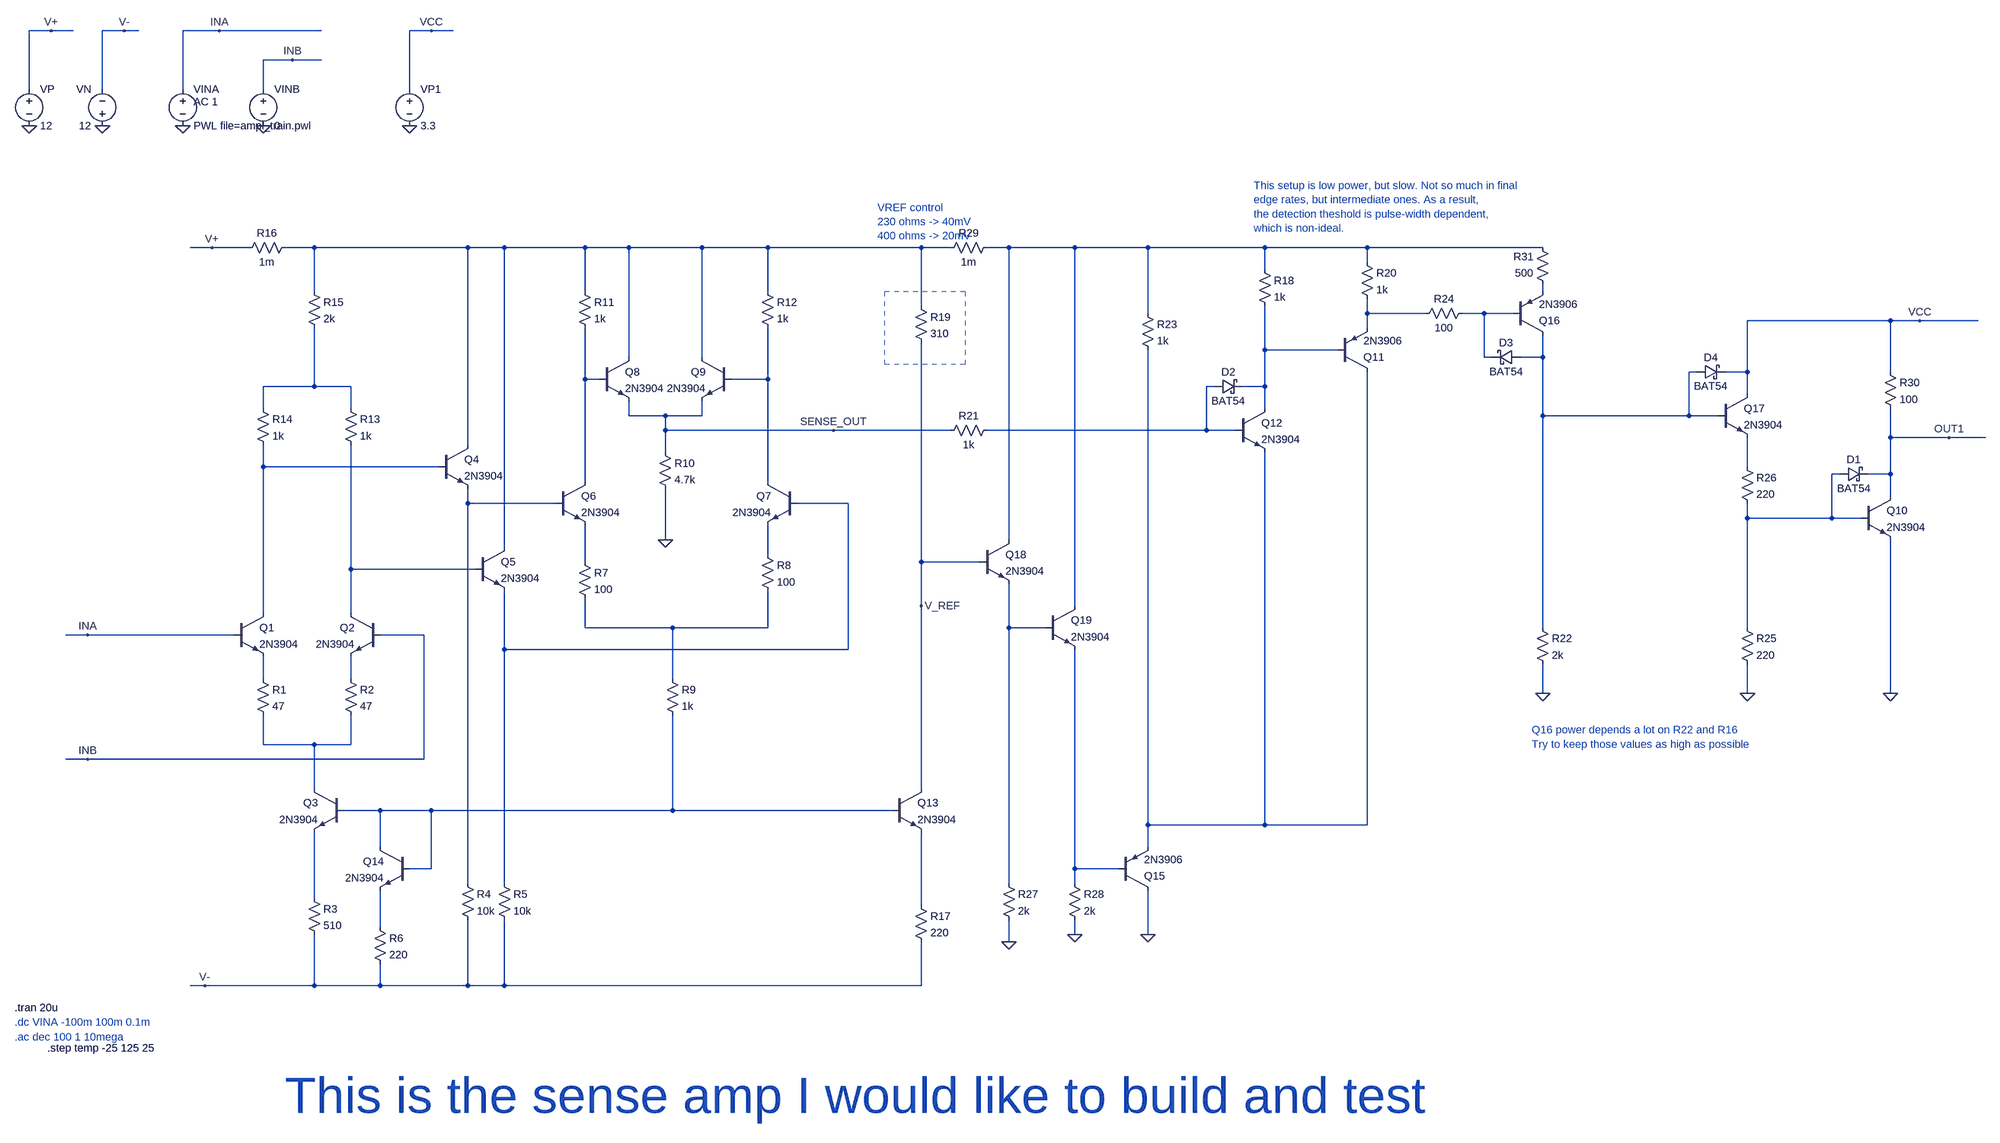
[diagram p0: schematic sense_amp2.asc]
sense_amp2.asc, the LTspice schematic file:
Version 4.1
SHEET 1 4868 1236
WIRE -224 -1328 -272 -1328
WIRE -176 -1328 -224 -1328
WIRE -64 -1328 -112 -1328
WIRE -32 -1328 -64 -1328
WIRE 144 -1328 64 -1328
WIRE 368 -1328 144 -1328
WIRE 608 -1328 560 -1328
WIRE 656 -1328 608 -1328
WIRE 304 -1264 240 -1264
WIRE 368 -1264 304 -1264
WIRE -272 -1200 -272 -1328
WIRE -112 -1200 -112 -1328
WIRE 64 -1200 64 -1328
WIRE 240 -1200 240 -1264
WIRE 560 -1200 560 -1328
WIRE 128 -688 80 -688
WIRE 208 -688 128 -688
WIRE 352 -688 288 -688
WIRE 688 -688 352 -688
WIRE 768 -688 688 -688
WIRE 944 -688 768 -688
WIRE 1040 -688 944 -688
WIRE 1200 -688 1040 -688
WIRE 1344 -688 1200 -688
WIRE 1680 -688 1344 -688
WIRE 1744 -688 1680 -688
WIRE 1872 -688 1824 -688
WIRE 2016 -688 1872 -688
WIRE 2176 -688 2016 -688
WIRE 2432 -688 2176 -688
WIRE 2656 -688 2432 -688
WIRE 3040 -688 2656 -688
WIRE 2656 -656 2656 -688
WIRE 2432 -640 2432 -688
WIRE 352 -592 352 -688
WIRE 944 -592 944 -688
WIRE 1344 -592 1344 -688
WIRE 3040 -592 3040 -608
WIRE 1680 -560 1680 -688
WIRE 2176 -544 2176 -688
WIRE 2656 -544 2656 -576
WIRE 2784 -544 2656 -544
WIRE 2912 -544 2864 -544
WIRE 2976 -544 2912 -544
WIRE 3856 -528 3488 -528
WIRE 3920 -528 3856 -528
WIRE 4048 -528 3920 -528
WIRE 2656 -512 2656 -544
WIRE 2432 -464 2432 -560
WIRE 2592 -464 2432 -464
WIRE 1040 -448 1040 -688
WIRE 1200 -448 1200 -688
WIRE 2912 -448 2912 -544
WIRE 2928 -448 2912 -448
WIRE 3040 -448 3040 -496
WIRE 3040 -448 2992 -448
WIRE 3376 -416 3360 -416
WIRE 3488 -416 3488 -528
WIRE 3488 -416 3440 -416
WIRE 3856 -416 3856 -528
WIRE 944 -400 944 -512
WIRE 976 -400 944 -400
WIRE 1344 -400 1344 -512
WIRE 1344 -400 1264 -400
WIRE 352 -384 352 -512
WIRE 352 -384 240 -384
WIRE 432 -384 352 -384
WIRE 2320 -384 2304 -384
WIRE 2432 -384 2432 -464
WIRE 2432 -384 2384 -384
WIRE 3488 -368 3488 -416
WIRE 240 -336 240 -384
WIRE 432 -336 432 -384
WIRE 2432 -336 2432 -384
WIRE 1040 -320 1040 -352
WIRE 1120 -320 1040 -320
WIRE 1200 -320 1200 -352
WIRE 1200 -320 1120 -320
WIRE 3040 -320 3040 -448
WIRE 3360 -320 3360 -416
WIRE 3360 -320 3040 -320
WIRE 3424 -320 3360 -320
WIRE 1120 -288 1120 -320
WIRE 1488 -288 1120 -288
WIRE 1744 -288 1488 -288
WIRE 2304 -288 2304 -384
WIRE 2304 -288 1824 -288
WIRE 2368 -288 2304 -288
WIRE 3856 -272 3856 -336
WIRE 3984 -272 3856 -272
WIRE 4064 -272 3984 -272
WIRE 688 -256 688 -688
WIRE 1120 -240 1120 -288
WIRE 240 -208 240 -256
WIRE 624 -208 240 -208
WIRE 3488 -208 3488 -272
WIRE 3744 -192 3728 -192
WIRE 3856 -192 3856 -272
WIRE 3856 -192 3808 -192
WIRE 944 -176 944 -400
WIRE 1344 -176 1344 -400
WIRE 3856 -144 3856 -192
WIRE 688 -128 688 -160
WIRE 880 -128 688 -128
WIRE 1520 -128 1408 -128
WIRE 3488 -96 3488 -128
WIRE 3728 -96 3728 -192
WIRE 3728 -96 3488 -96
WIRE 3792 -96 3728 -96
WIRE 1120 -48 1120 -160
WIRE 1872 -48 1872 -688
WIRE 768 -32 768 -688
WIRE 1344 -16 1344 -80
WIRE 944 0 944 -80
WIRE 1680 0 1680 -480
WIRE 1808 0 1680 0
WIRE 432 16 432 -256
WIRE 704 16 432 16
WIRE 1680 96 1680 0
WIRE 2016 96 2016 -688
WIRE 240 112 240 -208
WIRE 432 112 432 16
WIRE 944 144 944 80
WIRE 1136 144 944 144
WIRE 1344 144 1344 64
WIRE 1344 144 1136 144
WIRE 1872 144 1872 48
WIRE 1952 144 1872 144
WIRE 3040 144 3040 -320
WIRE 3488 144 3488 -96
WIRE -144 160 -192 160
WIRE 176 160 -144 160
WIRE 592 160 496 160
WIRE 768 192 768 64
WIRE 1520 192 1520 -128
WIRE 1520 192 768 192
WIRE 240 256 240 208
WIRE 432 256 432 208
WIRE 1136 256 1136 144
WIRE 3040 288 3040 224
WIRE 3488 288 3488 224
WIRE 3856 288 3856 -48
WIRE 240 400 240 336
WIRE 352 400 240 400
WIRE 432 400 432 336
WIRE 432 400 352 400
WIRE -144 432 -192 432
WIRE 592 432 592 160
WIRE 592 432 -144 432
WIRE 352 496 352 400
WIRE 1680 496 1680 96
WIRE 496 544 416 544
WIRE 608 544 496 544
WIRE 1136 544 1136 336
WIRE 1136 544 608 544
WIRE 1616 544 1136 544
WIRE 2176 576 2176 -464
WIRE 2432 576 2432 -240
WIRE 2432 576 2176 576
WIRE 2656 576 2656 -416
WIRE 2656 576 2432 576
WIRE 496 624 496 544
WIRE 2176 624 2176 576
WIRE 608 672 608 544
WIRE 608 672 560 672
WIRE 2016 672 2016 192
WIRE 2112 672 2016 672
WIRE 688 704 688 -128
WIRE 768 704 768 192
WIRE 1872 704 1872 144
WIRE 2016 704 2016 672
WIRE 352 736 352 592
WIRE 1680 752 1680 592
WIRE 496 800 496 720
WIRE 2016 816 2016 784
WIRE 2176 816 2176 720
WIRE 1872 832 1872 784
WIRE 112 928 80 928
WIRE 352 928 352 816
WIRE 352 928 112 928
WIRE 496 928 496 880
WIRE 496 928 352 928
WIRE 688 928 688 784
WIRE 688 928 496 928
WIRE 768 928 768 784
WIRE 768 928 688 928
WIRE 1680 928 1680 832
WIRE 1680 928 768 928
FLAG 1488 -288 SENSE_OUT
FLAG -144 160 INA
FLAG -144 432 INB
FLAG 128 -688 V+
FLAG 112 928 V-
FLAG -272 -1120 0
FLAG 64 -1120 0
FLAG -112 -1120 0
FLAG 240 -1120 0
FLAG -224 -1328 V+
FLAG -64 -1328 V-
FLAG 144 -1328 INA
FLAG 304 -1264 INB
FLAG 1120 -48 0
FLAG 1680 96 V_REF
FLAG 2176 816 0
FLAG 3040 288 0
FLAG 3984 -272 OUT1
FLAG 560 -1120 0
FLAG 608 -1328 VCC
FLAG 3856 288 0
FLAG 3920 -528 VCC
FLAG 3488 288 0
FLAG 1872 832 0
FLAG 2016 816 0
SYMBOL npn 176 112 R0
SYMATTR InstName Q1
SYMATTR Value 2N3904
SYMBOL res 224 240 R0
SYMATTR InstName R1
SYMATTR Value 47
SYMBOL res 416 240 R0
SYMATTR InstName R2
SYMATTR Value 47
SYMBOL npn 496 112 M0
SYMATTR InstName Q2
SYMATTR Value 2N3904
SYMBOL npn 416 496 M0
SYMATTR InstName Q3
SYMATTR Value 2N3904
SYMBOL npn 624 -256 R0
SYMATTR InstName Q4
SYMATTR Value 2N3904
SYMBOL npn 704 -32 R0
SYMATTR InstName Q5
SYMATTR Value 2N3904
SYMBOL npn 880 -176 R0
SYMATTR InstName Q6
SYMATTR Value 2N3904
SYMBOL npn 1408 -176 M0
SYMATTR InstName Q7
SYMATTR Value 2N3904
SYMBOL npn 976 -448 R0
SYMATTR InstName Q8
SYMATTR Value 2N3904
SYMBOL npn 1264 -448 M0
SYMATTR InstName Q9
SYMATTR Value 2N3904
SYMBOL res 336 720 R0
SYMATTR InstName R3
SYMATTR Value 510
SYMBOL res 672 688 R0
SYMATTR InstName R4
SYMATTR Value 10k
SYMBOL res 752 688 R0
SYMATTR InstName R5
SYMATTR Value 10k
SYMBOL res 480 784 R0
SYMATTR InstName R6
SYMATTR Value 220
SYMBOL res 928 -16 R0
SYMATTR InstName R7
SYMATTR Value 100
SYMBOL res 1328 -32 R0
SYMATTR InstName R8
SYMATTR Value 100
SYMBOL res 1120 240 R0
SYMATTR InstName R9
SYMATTR Value 1k
SYMBOL res 1104 -256 R0
SYMATTR InstName R10
SYMATTR Value 4.7k
SYMBOL res 928 -608 R0
SYMATTR InstName R11
SYMATTR Value 1k
SYMBOL res 1328 -608 R0
SYMATTR InstName R12
SYMATTR Value 1k
SYMBOL res 416 -352 R0
SYMATTR InstName R13
SYMATTR Value 1k
SYMBOL res 224 -352 R0
SYMATTR InstName R14
SYMATTR Value 1k
SYMBOL res 336 -608 R0
SYMATTR InstName R15
SYMATTR Value 2k
SYMBOL voltage -272 -1216 R0
SYMATTR InstName VP
SYMATTR Value 12
SYMBOL voltage -112 -1104 R180
WINDOW 0 24 96 Left 2
WINDOW 3 24 16 Left 2
SYMATTR InstName VN
SYMATTR Value 12
SYMBOL voltage 64 -1216 R0
WINDOW 123 24 44 Left 2
WINDOW 39 0 0 Left 0
SYMATTR Value2 AC 1
SYMATTR InstName VINA
SYMATTR Value PWL file=ampl_train.pwl
SYMBOL voltage 240 -1216 R0
WINDOW 123 0 0 Left 0
WINDOW 39 0 0 Left 0
SYMATTR InstName VINB
SYMATTR Value 0
SYMBOL npn 560 624 M0
SYMATTR InstName Q14
SYMATTR Value 2N3904
SYMBOL npn 2368 -336 R0
SYMATTR InstName Q12
SYMATTR Value 2N3904
SYMBOL npn 1616 496 R0
SYMATTR InstName Q13
SYMATTR Value 2N3904
SYMBOL res 1664 736 R0
SYMATTR InstName R17
SYMATTR Value 220
SYMBOL res 1664 -576 R0
SYMATTR InstName R19
SYMATTR Value 310
SYMBOL res 1840 -304 R90
WINDOW 0 0 56 VBottom 2
WINDOW 3 32 56 VTop 2
SYMATTR InstName R21
SYMATTR Value 1k
SYMBOL res 2160 -560 R0
SYMATTR InstName R23
SYMATTR Value 1k
SYMBOL res 3024 128 R0
SYMATTR InstName R22
SYMATTR Value 2k
SYMBOL pnp 2976 -496 M180
SYMATTR InstName Q16
SYMATTR Value 2N3906
SYMBOL voltage 560 -1216 R0
SYMATTR InstName VP1
SYMATTR Value 3.3
SYMBOL res 3840 -432 R0
SYMATTR InstName R30
SYMATTR Value 100
SYMBOL res 2416 -656 R0
SYMATTR InstName R18
SYMATTR Value 1k
SYMBOL npn 3792 -144 R0
SYMATTR InstName Q10
SYMATTR Value 2N3904
SYMBOL schottky 3744 -176 R270
WINDOW 0 32 32 VTop 2
WINDOW 3 0 32 VBottom 2
SYMATTR InstName D1
SYMATTR Value BAT54
SYMATTR Description Diode
SYMATTR Type diode
SYMBOL schottky 2320 -368 R270
WINDOW 0 32 32 VTop 2
WINDOW 3 0 32 VBottom 2
SYMATTR InstName D2
SYMATTR Value BAT54
SYMATTR Description Diode
SYMATTR Type diode
SYMBOL res 2640 -672 R0
SYMATTR InstName R20
SYMATTR Value 1k
SYMBOL pnp 2592 -416 M180
SYMATTR InstName Q11
SYMATTR Value 2N3906
SYMBOL schottky 2992 -432 M270
WINDOW 0 32 32 VTop 2
WINDOW 3 0 32 VBottom 2
SYMATTR InstName D3
SYMATTR Value BAT54
SYMATTR Description Diode
SYMATTR Type diode
SYMBOL res 2880 -560 R90
WINDOW 0 0 56 VBottom 2
WINDOW 3 32 56 VTop 2
SYMATTR InstName R24
SYMATTR Value 100
SYMBOL npn 3424 -368 R0
SYMATTR InstName Q17
SYMATTR Value 2N3904
SYMBOL res 3472 128 R0
SYMATTR InstName R25
SYMATTR Value 220
SYMBOL res 3472 -224 R0
SYMATTR InstName R26
SYMATTR Value 220
SYMBOL schottky 3376 -400 R270
WINDOW 0 32 32 VTop 2
WINDOW 3 0 32 VBottom 2
SYMATTR InstName D4
SYMATTR Value BAT54
SYMATTR Description Diode
SYMATTR Type diode
SYMBOL pnp 2112 720 M180
SYMATTR InstName Q15
SYMATTR Value 2N3906
SYMBOL npn 1808 -48 R0
SYMATTR InstName Q18
SYMATTR Value 2N3904
SYMBOL res 1856 688 R0
SYMATTR InstName R27
SYMATTR Value 2k
SYMBOL npn 1952 96 R0
SYMATTR InstName Q19
SYMATTR Value 2N3904
SYMBOL res 2000 688 R0
SYMATTR InstName R28
SYMATTR Value 2k
SYMBOL res 1728 -672 R270
WINDOW 0 32 56 VTop 2
WINDOW 3 0 56 VBottom 2
SYMATTR InstName R29
SYMATTR Value 1m
SYMBOL res 3056 -592 R180
WINDOW 0 36 76 Left 2
WINDOW 3 36 40 Left 2
SYMATTR InstName R31
SYMATTR Value 500
SYMBOL res 192 -672 R270
WINDOW 0 32 56 VTop 2
WINDOW 3 0 56 VBottom 2
SYMATTR InstName R16
SYMATTR Value 1m
TEXT -304 976 Left 2 !.tran 20u
TEXT -304 1008 Left 2 ;.dc VINA -100m 100m 0.1m
TEXT -232 1064 Left 2 !.step temp -25 125 25
TEXT 1584 -776 Left 2 ;VREF control\n230 ohms -> 40mV\n400 ohms -> 20mV
TEXT -304 1040 Left 2 ;.ac dec 100 1 10mega
TEXT 288 1168 Left 7 ;This is the sense amp I would like to build and test
TEXT 3016 368 Left 2 ;Q16 power depends a lot on R22 and R16\nTry to keep those values as high as possible
TEXT 2408 -824 Left 2 ;This setup is low power, but slow. Not so much in final\nedge rates, but intermediate ones. As a result,\nthe detection theshold is pulse-width dependent,\nwhich is non-ideal.
RECTANGLE Normal 1776 -432 1600 -592 2

The netlist it stands for:
* sense_amp2.asc
Q1 N012 INA N022 0 2N3904
R1 N022 N024 47
R2 N023 N024 47
Q2 N019 INB N023 0 2N3904
Q3 N024 N025 N028 0 2N3904
Q4 N001 N012 N015 0 2N3904
Q5 N001 N019 N016 0 2N3904
Q6 N008 N015 N018 0 2N3904
Q7 N009 N016 N017 0 2N3904
Q8 N001 N008 SENSE_OUT 0 2N3904
Q9 N001 N009 SENSE_OUT 0 2N3904
R3 N028 V- 510
R4 N015 V- 10k
R5 N016 V- 10k
R6 N030 V- 220
R7 N018 N020 100
R8 N017 N020 100
R9 N020 N025 1k
R10 SENSE_OUT 0 4.7k
R11 N001 N008 1k
R12 N001 N009 1k
R13 N010 N019 1k
R14 N010 N012 1k
R15 N001 N010 2k
VP V+ 0 12
VN 0 V- 12
VINA INA 0 PWL file=ampl_train.pwl AC 1
VINB INB 0 0
Q14 N025 N025 N030 0 2N3904
Q12 N006 N011 N026 0 2N3904
Q13 V_REF N025 N029 0 2N3904
R17 N029 V- 220
R19 N001 V_REF 310
R21 N011 SENSE_OUT 1k
R23 N002 N026 1k
R22 N007 0 2k
Q16 N007 N005 N003 0 2N3906
VP1 VCC 0 3.3
R30 VCC OUT1 100
R18 N002 N006 1k
Q10 OUT1 N014 0 0 2N3904
D1 N014 OUT1 BAT54
D2 N011 N006 BAT54
R20 N002 N004 1k
Q11 N026 N006 N004 0 2N3906
D3 N007 N005 BAT54
R24 N005 N004 100
Q17 VCC N007 N013 0 2N3904
R25 N014 0 220
R26 N013 N014 220
D4 N007 VCC BAT54
Q15 0 N027 N026 0 2N3906
Q18 N002 V_REF N021 0 2N3904
R27 N021 0 2k
Q19 N002 N021 N027 0 2N3904
R28 N027 0 2k
R29 N001 N002 1m
R31 N003 N002 500
R16 V+ N001 1m
.model D D
.lib standard.dio
.model NPN NPN
.model PNP PNP
.lib standard.bjt
.tran 20u
* .dc VINA -100m 100m 0.1m
.step temp -25 125 25
* VREF control
* 230 ohms -> 40mV
* 400 ohms -> 20mV
* .ac dec 100 1 10mega
* This is the sense amp I would like to build and test
* Q16 power depends a lot on R22 and R16
* Try to keep those values as high as possible
* This setup is low power, but slow. Not so much in final
* edge rates, but intermediate ones. As a result,
* the detection theshold is pulse-width dependent,
* which is non-ideal.
.backanno
.end